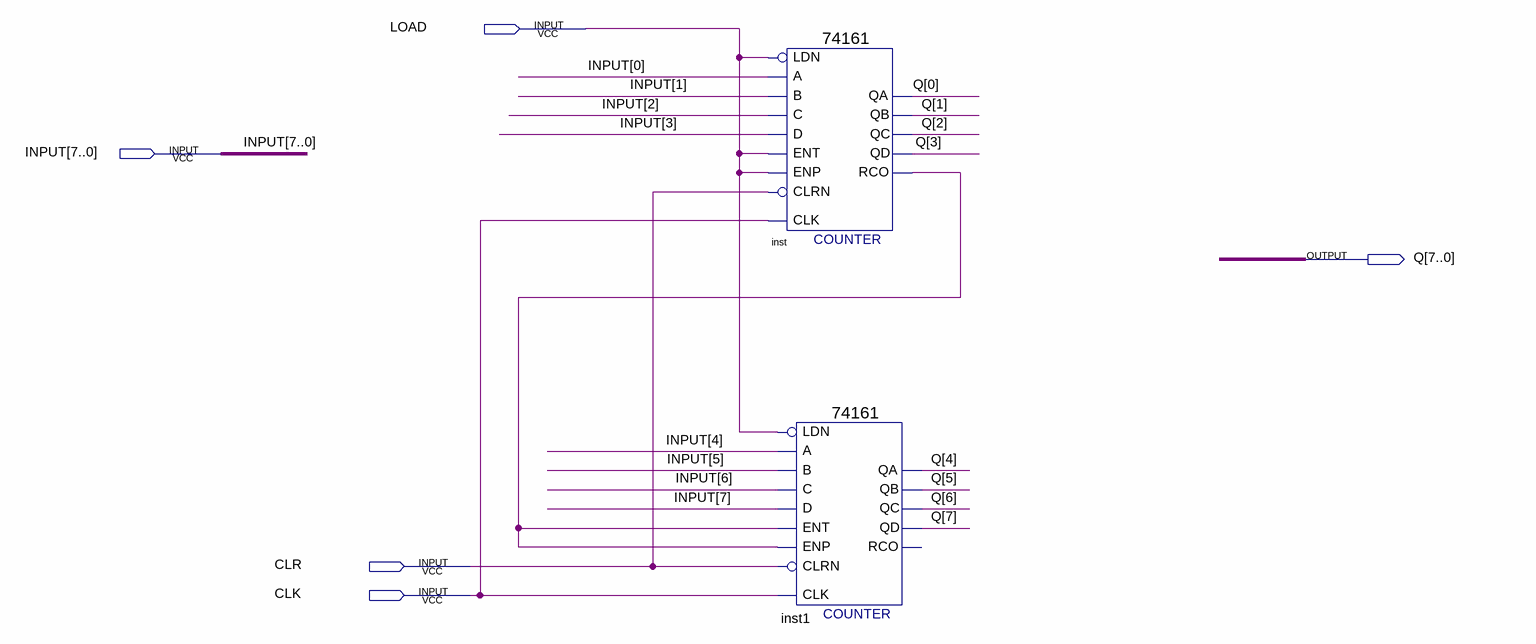
[diagram p0: schematic sheet]
// Quartus schematic uPC.bdf as structural Verilog: 2 symbols, 5 pins
module uPC (
  input  LOAD,
  input  [7:0] INPUT,
  input  CLR,
  input  CLK,
  output [7:0] Q
);

  wire inst_rco;

  \74161  inst (
    .CLRN(CLR), .CLK(CLK), .ENP(LOAD), .LDN(LOAD), .A(INPUT[0]), .D(INPUT[3]), .ENT(LOAD), .B(INPUT[1]),
    .C(INPUT[2]), .QD(Q[3]), .QC(Q[2]), .QB(Q[1]), .QA(Q[0]), .RCO(inst_rco));
  \74161  inst1 (
    .CLRN(CLR), .CLK(CLK), .ENP(inst_rco), .LDN(LOAD), .A(INPUT[4]), .D(INPUT[7]), .ENT(inst_rco),
    .B(INPUT[5]), .C(INPUT[6]), .QD(Q[7]), .QC(Q[6]), .QB(Q[5]), .QA(Q[4]));  // open: RCO
endmodule
